# EAGLE design Board_S1_sche (EAGLE 6.2)
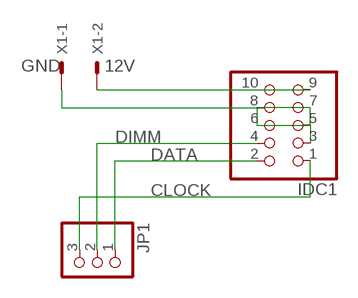
[diagram p0: schematic, sheet 1]

## Parts
IDC1  PINHD-2X5  [2X05]
JP1  PINHD-1X3  [1X03]
X1  KK-156-2  [KK-156-2]

## Nets
12V: IDC1.9 IDC1.10 X1.2
CLOCK: IDC1.1 JP1.3
DATA: IDC1.2 JP1.1
DIMM: IDC1.4 JP1.2
GND: IDC1.3 IDC1.5 IDC1.6 IDC1.7 IDC1.8 X1.1

## Library data of the parts
IDC1 = pinhead:PINHD-2X5: PIN HEADER
JP1 = pinhead:PINHD-1X3: PIN HEADER
X1 = con-molex:KK-156-2: KK 156 HEADER Source: http://www.molex.com/pdm_docs/sd/026604100_sd.pdf; OC_FARNELL: unknown; OC_NEWARK: unknown

## Net classes
0 default: width 0.254 mm, drill 0.508 mm, clearance 0.254 mm

## Board
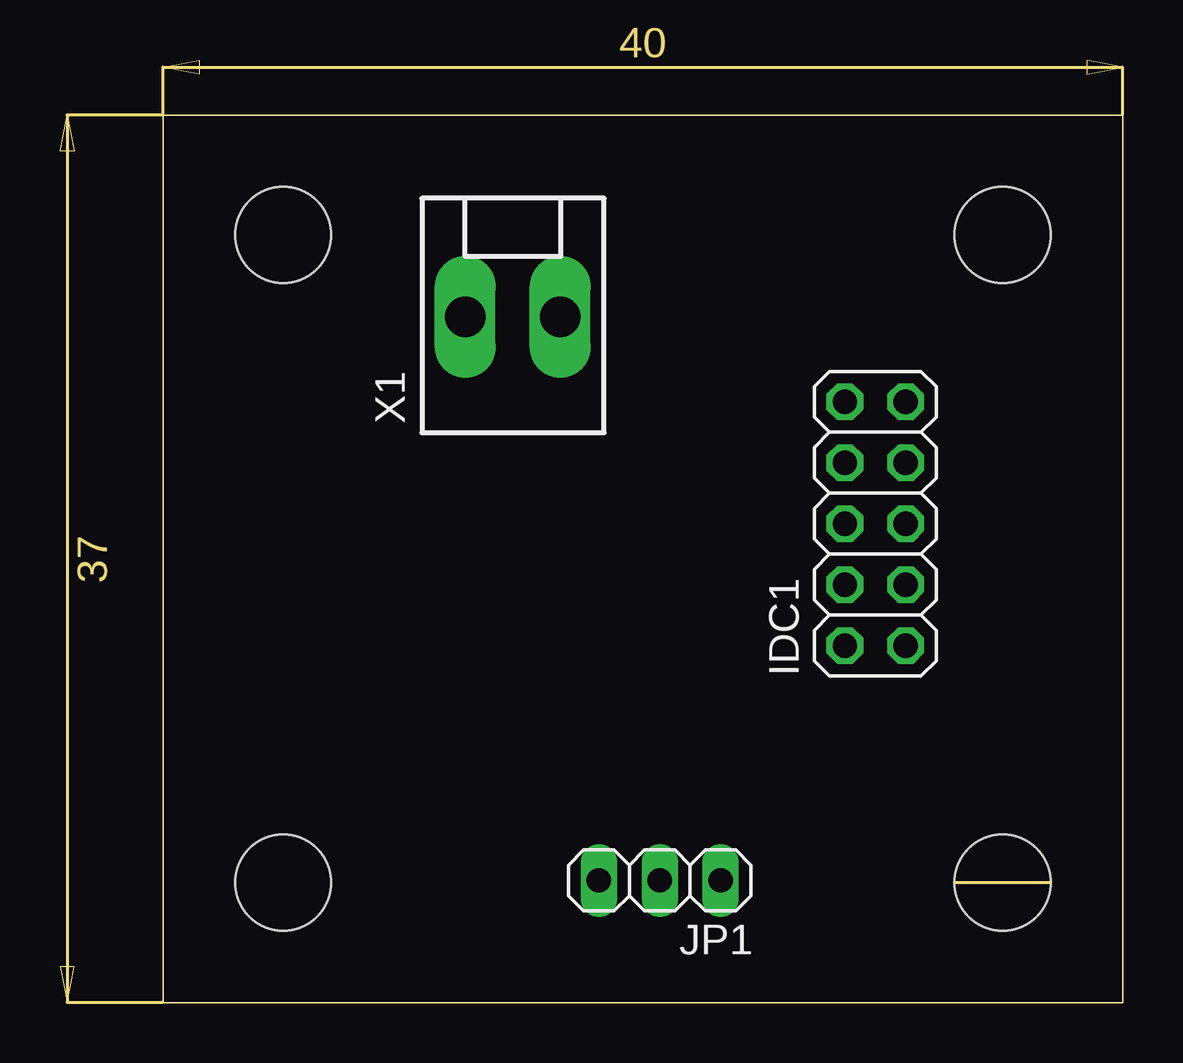
[diagram p1: board, top side]
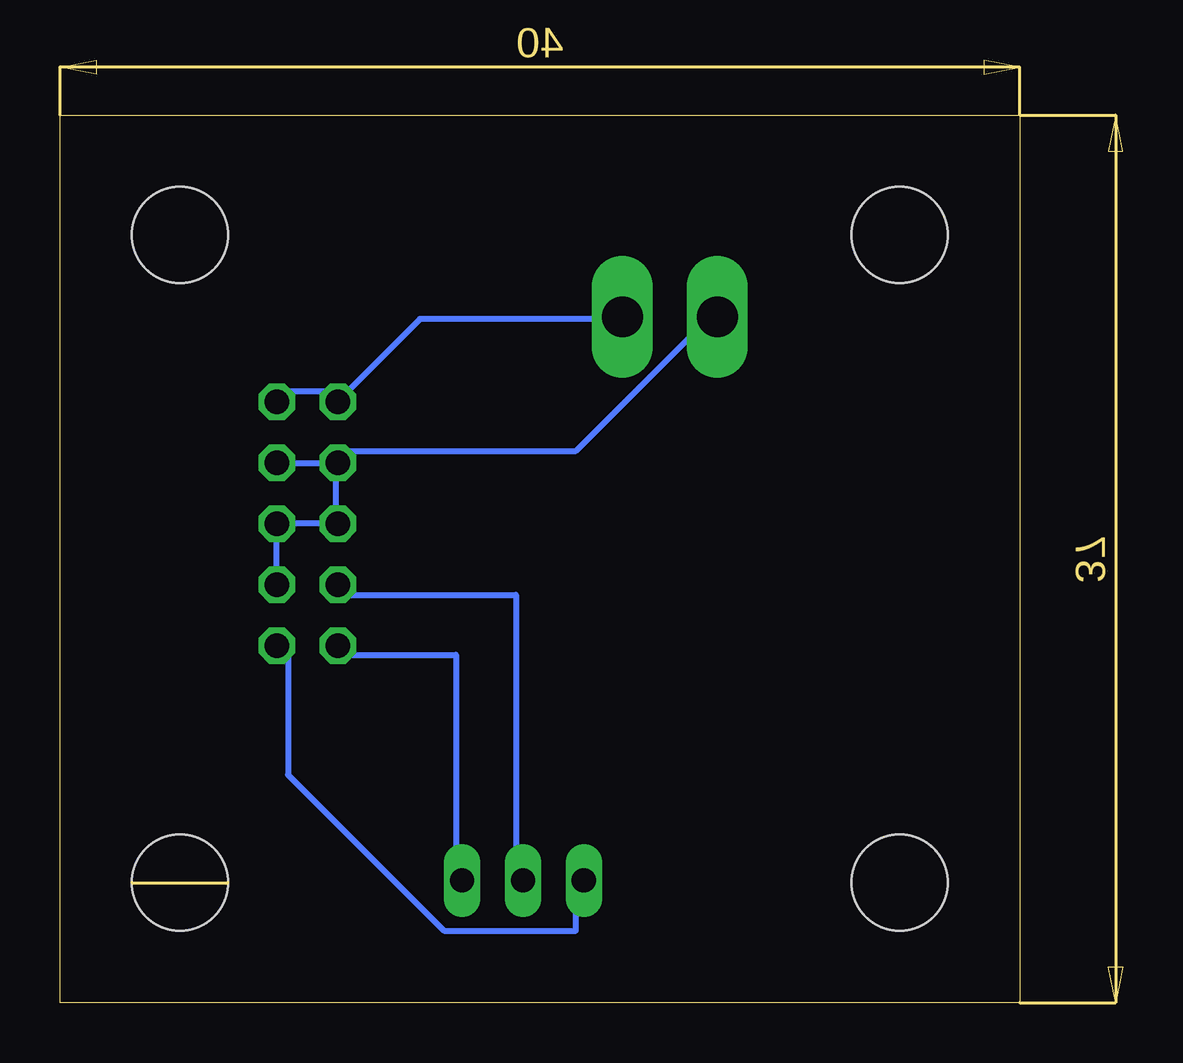
[diagram p2: board, bottom side, seen from below]

Size 40 x 37 mm. Coordinates in mm from the lower left corner, seen from the top.
Outline: 0,0 40,0 40,37 0,37 0,0
Copper layers (1*16): Top 0.035mm / dielectric 1.5mm / Bottom 0.035mm
Design rules: minimum track width 10mil, minimum drill 24mil, track to track 12mil, track to pad 8mil, pad to pad 8mil, via to via 8mil, smd to smd 8mil, copper to edge 40mil, drill to drill 8mil, minimum pad ring 10mil, minimum via ring 8mil, stop-mask expansion 4mil, vias tented up to drill 0mil, thermal gap 10mil
Holes 4 mm at 5,5 5,32 35,32 35,5

### Footprints (pad centres in the part's own frame; a part is rotated, then mirrored left to right if it is on the bottom)
2X05 = drill 1.016 octagon: 1 -5.08,-1.27; 2 -5.08,1.27; 3 -2.54,-1.27; 4 -2.54,1.27; 5 0,-1.27; 6 0,1.27; 7 2.54,-1.27; 8 2.54,1.27; 9 5.08,-1.27; 10 5.08,1.27
1X03 = drill 1.016 long: 1 -2.54,0; 2 0,0; 3 2.54,0
KK-156-2 = drill 1.7 pad 2.184 long: 1 -1.98,0; 2 1.98,0

### Placement (x,y rotation side)
IDC1  29.69,19.97 90 top
JP1  20.7,5.1 180 top
X1  14.57,28.59 0 top

### Tracks (layer width: path | path; a pad name or v marks a point on that pad's centre or on a via)
12V
  Bottom 0.254: IDC1.9 30.5,25.5 28.5,25.5 IDC1.10 28,25.5 25,28.5 17,28.5 X1.2
CLOCK
  Bottom 0.254: JP1.3 18.5,5 18.5,3 24,3 30.5,9.5 30.5,14.5 IDC1.1
DATA
  Bottom 0.254: JP1.1 23.5,5.5 23.5,14.5 28,14.5 IDC1.2
DIMM
  Bottom 0.254: JP1.2 21,5.5 21,17 28,17 IDC1.4
GND
  Bottom 0.254: 28.5,22.5 30.5,22.5 IDC1.7 | IDC1.3 31,17.5 31,19.5 IDC1.5 30.5,20 28.5,20 | 28.5,20 28.5,22.5 | 28.5,22.5 IDC1.8 28,23 18.5,23 13,28.5 X1.1 | 28.5,20 IDC1.6